# EAGLE design 3_cpu_control (EAGLE 6.6.0)

## Sheet 1 of 2
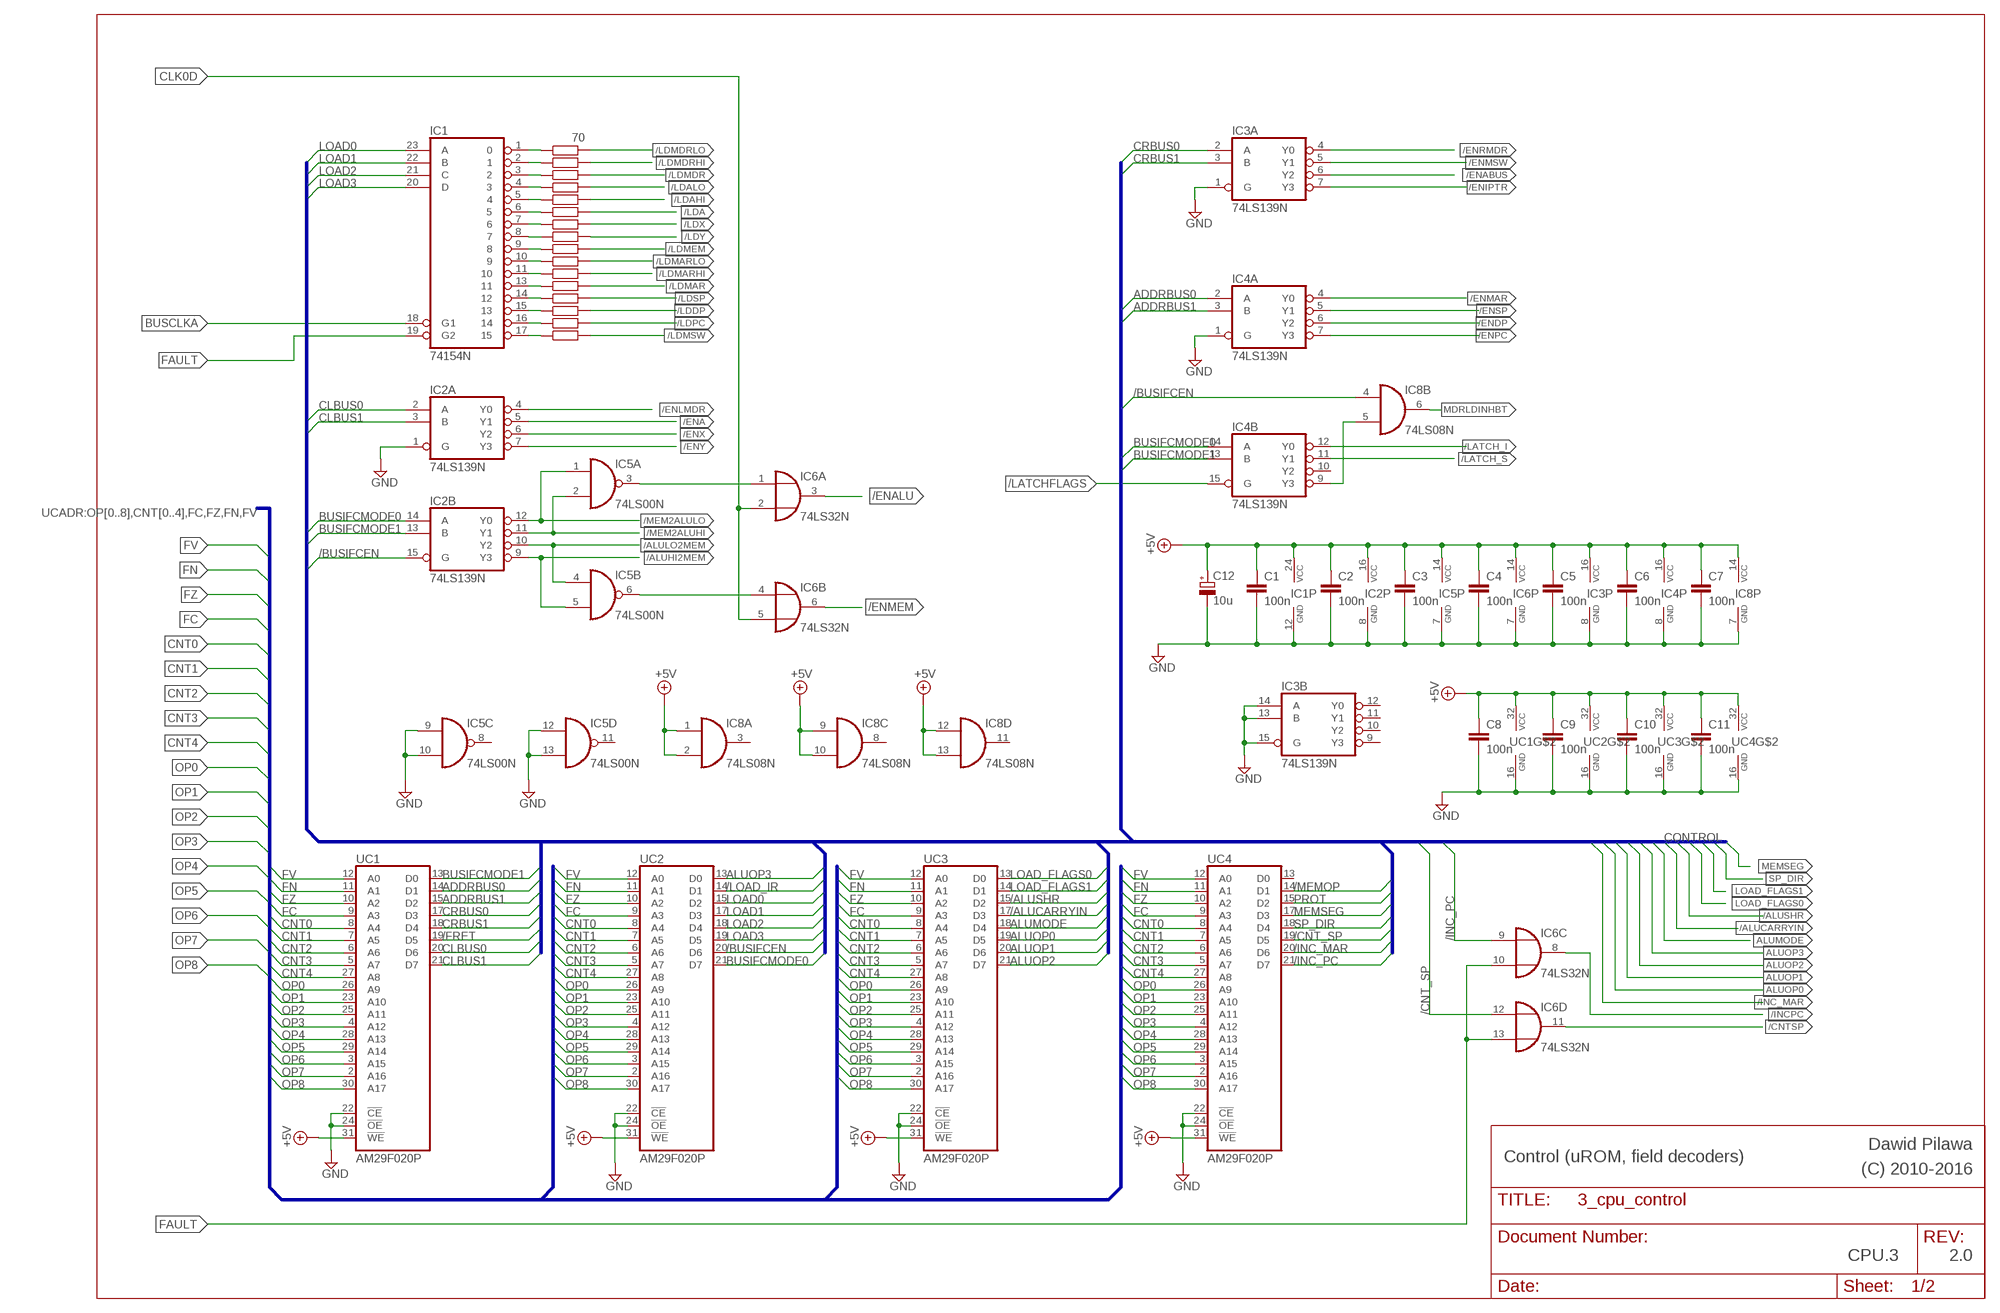
[diagram p0: schematic, sheet 1]

### Parts
C1  100n  C-EU050-024X044  [C050-024X044]
C2  100n  C-EU050-024X044  [C050-024X044]
C3  100n  C-EU050-024X044  [C050-024X044]
C4  100n  C-EU050-024X044  [C050-024X044]
C5  100n  C-EU050-024X044  [C050-024X044]
C6  100n  C-EU050-024X044  [C050-024X044]
C7  100n  C-EU050-024X044  [C050-024X044]
C8  100n  C-EU050-024X044  [C050-024X044]
C9  100n  C-EU050-024X044  [C050-024X044]
C10  100n  C-EU050-024X044  [C050-024X044]
C11  100n  C-EU050-024X044  [C050-024X044]
C12  10u  CPOL-EUE5-6  [E5-6]
IC1  74154N  [DIL24-6]
IC2  74LS139N  [DIL16]
IC3  74LS139N  [DIL16]
IC4  74LS139N  [DIL16]
IC5  74LS00N  [DIL14]
IC6  74LS32N  [DIL14]
IC8  74LS08N  [DIL14]
R1  70  R-EU_0204/7  [0204/7]
R2  R-EU_0204/7  [0204/7]
R3  R-EU_0204/7  [0204/7]
R4  R-EU_0204/7  [0204/7]
R5  R-EU_0204/7  [0204/7]
R6  R-EU_0204/7  [0204/7]
R7  R-EU_0204/7  [0204/7]
R8  R-EU_0204/7  [0204/7]
R9  R-EU_0204/7  [0204/7]
R10  R-EU_0204/7  [0204/7]
R11  R-EU_0204/7  [0204/7]
R12  R-EU_0204/7  [0204/7]
R13  R-EU_0204/7  [0204/7]
R14  R-EU_0204/7  [0204/7]
R15  R-EU_0204/7  [0204/7]
R16  R-EU_0204/7  [0204/7]
UC1  AM29F020P  [DIL32-6]
UC2  AM29F020P  [DIL32-6]
UC3  AM29F020P  [DIL32-6]
UC4  AM29F020P  [DIL32-6]

### Nets
+5V: C1.1 C2.1 C3.1 C4.1 C5.1 C6.1 C7.1 C8.1 C9.1 C10.1 C11.1 C12.+ IC1.24(VCC) IC2.16(P:VCC) IC3.16(P:VCC) IC4.16(P:VCC) IC5.14(P:VCC) IC6.14(P:VCC) IC8.1(A:I0) IC8.2(A:I1) IC8.9(C:I0) IC8.10(C:I1) IC8.12(D:I0) IC8.13(D:I1) IC8.14(P:VCC) UC1.31(!WE) UC1.32(AVCC) UC2.31(!WE) UC2.32(AVCC) UC3.31(!WE) UC3.32(AVCC) UC4.31(!WE) UC4.32(AVCC) ; also sheet 2
/ALUCARRYIN: UC3.17(D3) ; also sheet 2
/ALUHI2MEM: IC2.9(B:Y3) IC5.5(B:I1) ; also sheet 2
/ALULO2MEM: IC2.10(B:Y2) IC5.4(B:I0) ; also sheet 2
/ALUSHR: UC3.15(D2) ; also sheet 2
/BUSIFCEN: IC2.15(B:G) IC8.4(B:I0) UC2.20(D6) ; also sheet 2
/CNT_SP: IC6.12(D:I0) UC4.19(D5)
/CNTSP: IC6.11(D:O) ; also sheet 2
/ENA: IC2.5(A:Y1) ; also sheet 2
/ENABUS: IC3.6(A:Y2) ; also sheet 2
/ENALU: IC6.3(A:O) ; also sheet 2
/ENDP: IC4.6(A:Y2) ; also sheet 2
/ENIPTR: IC3.7(A:Y3) ; also sheet 2
/ENLMDR: IC2.4(A:Y0) ; also sheet 2
/ENMAR: IC4.4(A:Y0) ; also sheet 2
/ENMEM: IC6.6(B:O) ; also sheet 2
/ENMSW: IC3.5(A:Y1) ; also sheet 2
/ENPC: IC4.7(A:Y3) ; also sheet 2
/ENRMDR: IC3.4(A:Y0) ; also sheet 2
/ENSP: IC4.5(A:Y1) ; also sheet 2
/ENX: IC2.6(A:Y2) ; also sheet 2
/ENY: IC2.7(A:Y3) ; also sheet 2
/FRET: UC1.19(D5) ; also sheet 2
/INC_MAR: UC4.20(D6) ; also sheet 2
/INC_PC: IC6.9(C:I0) UC4.21(D7)
/INCPC: IC6.8(C:O) ; also sheet 2
/LATCH_I: IC4.12(B:Y0) ; also sheet 2
/LATCH_NONE: IC4.9(B:Y3) IC8.5(B:I1)
/LATCH_S: IC4.11(B:Y1) ; also sheet 2
/LATCHFLAGS: IC4.15(B:G) ; also sheet 2
/LDA: R6.2 ; also sheet 2
/LDAHI: R5.2 ; also sheet 2
/LDALO: R4.2 ; also sheet 2
/LDDP: R14.2 ; also sheet 2
/LDMAR: R12.2 ; also sheet 2
/LDMARHI: R11.2 ; also sheet 2
/LDMARLO: R10.2 ; also sheet 2
/LDMDR: R3.2 ; also sheet 2
/LDMDRHI: R2.2 ; also sheet 2
/LDMDRLO: R1.2 ; also sheet 2
/LDMEM: R9.2 ; also sheet 2
/LDMSW: R16.2 ; also sheet 2
/LDPC: R15.2 ; also sheet 2
/LDSP: R13.2 ; also sheet 2
/LDX: R7.2 ; also sheet 2
/LDY: R8.2 ; also sheet 2
/LOAD_IR: UC2.14(D1) ; also sheet 2
/MEM2ALUHI: IC2.11(B:Y1) IC5.2(A:I1) ; also sheet 2
/MEM2ALULO: IC2.12(B:Y0) IC5.1(A:I0) ; also sheet 2
/MEMOP: UC4.14(D1) ; also sheet 2
ADDRBUS0: IC4.2(A:A) UC1.14(D1)
ADDRBUS1: IC4.3(A:B) UC1.15(D2)
ALUMODE: UC3.18(D4) ; also sheet 2
ALUOP0: UC3.19(D5) ; also sheet 2
ALUOP1: UC3.20(D6) ; also sheet 2
ALUOP2: UC3.21(D7) ; also sheet 2
ALUOP3: UC2.13(D0) ; also sheet 2
BUSCLKA: IC1.18(G1) ; also sheet 2
BUSIFCMODE0: IC2.14(B:A) IC4.14(B:A) UC2.21(D7)
BUSIFCMODE1: IC2.13(B:B) IC4.13(B:B) UC1.13(D0)
CLBUS0: IC2.2(A:A) UC1.20(D6)
CLBUS1: IC2.3(A:B) UC1.21(D7)
CLK0D: IC6.2(A:I1) IC6.5(B:I1) ; also sheet 2
CNT0: UC1.8(A4) UC2.8(A4) UC3.8(A4) UC4.8(A4) ; also sheet 2
CNT1: UC1.7(A5) UC2.7(A5) UC3.7(A5) UC4.7(A5) ; also sheet 2
CNT2: UC1.6(A6) UC2.6(A6) UC3.6(A6) UC4.6(A6) ; also sheet 2
CNT3: UC1.5(A7) UC2.5(A7) UC3.5(A7) UC4.5(A7) ; also sheet 2
CNT4: UC1.27(A8) UC2.27(A8) UC3.27(A8) UC4.27(A8) ; also sheet 2
CRBUS0: IC3.2(A:A) UC1.17(D3)
CRBUS1: IC3.3(A:B) UC1.18(D4)
FAULT: IC1.19(G2) IC6.10(C:I1) IC6.13(D:I1) ; also sheet 2
FC: UC1.9(A3) UC2.9(A3) UC3.9(A3) UC4.9(A3) ; also sheet 2
FN: UC1.11(A1) UC2.11(A1) UC3.11(A1) UC4.11(A1) ; also sheet 2
FV: UC1.12(A0) UC2.12(A0) UC3.12(A0) UC4.12(A0) ; also sheet 2
FZ: UC1.10(A2) UC2.10(A2) UC3.10(A2) UC4.10(A2) ; also sheet 2
GND: C1.2 C2.2 C3.2 C4.2 C5.2 C6.2 C7.2 C8.2 C9.2 C10.2 C11.2 C12.- IC1.12(GND) IC2.1(A:G) IC2.8(P:GND) IC3.1(A:G) IC3.8(P:GND) IC3.13(B:B) IC3.14(B:A) IC3.15(B:G) IC4.1(A:G) IC4.8(P:GND) IC5.7(P:GND) IC5.9(C:I0) IC5.10(C:I1) IC5.12(D:I0) IC5.13(D:I1) IC6.7(P:GND) IC8.7(P:GND) UC1.16(AGND) UC1.22(!CE) UC1.24(!OE) UC2.16(AGND) UC2.22(!CE) UC2.24(!OE) UC3.16(AGND) UC3.22(!CE) UC3.24(!OE) UC4.16(AGND) UC4.22(!CE) UC4.24(!OE) ; also sheet 2
LOAD0: IC1.23(A) UC2.15(D2)
LOAD1: IC1.22(B) UC2.17(D3)
LOAD2: IC1.21(C) UC2.18(D4)
LOAD3: IC1.20(D) UC2.19(D5)
LOAD_FLAGS0: UC3.13(D0) ; also sheet 2
LOAD_FLAGS1: UC3.14(D1) ; also sheet 2
MDRLDINHBT: IC8.6(B:O) ; also sheet 2
MEMSEG: UC4.17(D3) ; also sheet 2
N$1: IC1.16 R15.1
N$8: IC5.3(A:O) IC6.1(A:I0)
N$15: IC5.6(B:O) IC6.4(B:I0)
N$31: IC1.1 R1.1
N$33: IC1.2 R2.1
N$34: IC1.3 R3.1
N$35: IC1.4 R4.1
N$36: IC1.5 R5.1
N$37: IC1.6 R6.1
N$38: IC1.7 R7.1
N$39: IC1.8 R8.1
N$40: IC1.9 R9.1
N$41: IC1.10 R10.1
N$42: IC1.11 R11.1
N$43: IC1.13 R12.1
N$44: IC1.14 R13.1
N$45: IC1.15 R14.1
N$56: IC1.17 R16.1
OP0: UC1.26(A9) UC2.26(A9) UC3.26(A9) UC4.26(A9) ; also sheet 2
OP1: UC1.23(A10) UC2.23(A10) UC3.23(A10) UC4.23(A10) ; also sheet 2
OP2: UC1.25(A11) UC2.25(A11) UC3.25(A11) UC4.25(A11) ; also sheet 2
OP3: UC1.4(A12) UC2.4(A12) UC3.4(A12) UC4.4(A12) ; also sheet 2
OP4: UC1.28(A13) UC2.28(A13) UC3.28(A13) UC4.28(A13) ; also sheet 2
OP5: UC1.29(A14) UC2.29(A14) UC3.29(A14) UC4.29(A14) ; also sheet 2
OP6: UC1.3(A15) UC2.3(A15) UC3.3(A15) UC4.3(A15) ; also sheet 2
OP7: UC1.2(A16) UC2.2(A16) UC3.2(A16) UC4.2(A16) ; also sheet 2
OP8: UC1.30(A17) UC2.30(A17) UC3.30(A17) UC4.30(A17) ; also sheet 2
PROT: UC4.15(D2) ; also sheet 2
SP_DIR: UC4.18(D4) ; also sheet 2
Unconnected: IC3.9(B:Y3) IC3.10(B:Y2) IC3.11(B:Y1) IC3.12(B:Y0) IC4.10(B:Y2) IC5.8(C:O) IC5.11(D:O) IC8.3(A:O) IC8.8(C:O) IC8.11(D:O) UC4.13(D0)

### Buses
UCADR:OP[0..8],CNT[0..4],FC,FZ,FN,FV
UCODE:CLBUS[0..1],CRBUS[0..2],ADDRBUS[0..1],BUSIFCMODE[0..1],/BUSIFCEN,LOAD[0..3],/LOAD_IR,ALUOP[0..3],ALUMODE,/ALUCARRYIN,/ALUSHR,LOAD_FLAGS[0..1],/INC_PC,/INC_MAR,/CNT_SP,SP_DIR,MEMSEG,PROT,NC[0..1],NEXTOP
UCODE:CLBUS[0..1],CRBUS[0..1],ADDRBUS[0..1],BUSIFCMODE[0..1],/BUSIFCEN,LOAD[0..3],/LOAD_IR,ALUOP[0..3],ALUMODE,/ALUCARRYIN,/ALUSHR,LOAD_FLAGS[0..1],/INC_PC,/INC_MAR,/CNT_SP,SP_DIR,MEMSEG,PROT,NC[0..1],NEXTOP,/MEMOP,/FRET

### Notes on the sheet
- CONTROL
- Dawid Pilawa
- Control (uROM, field decoders) | (C) 2010-2016
- CPU.3 | 2.0

## Sheet 2 of 2
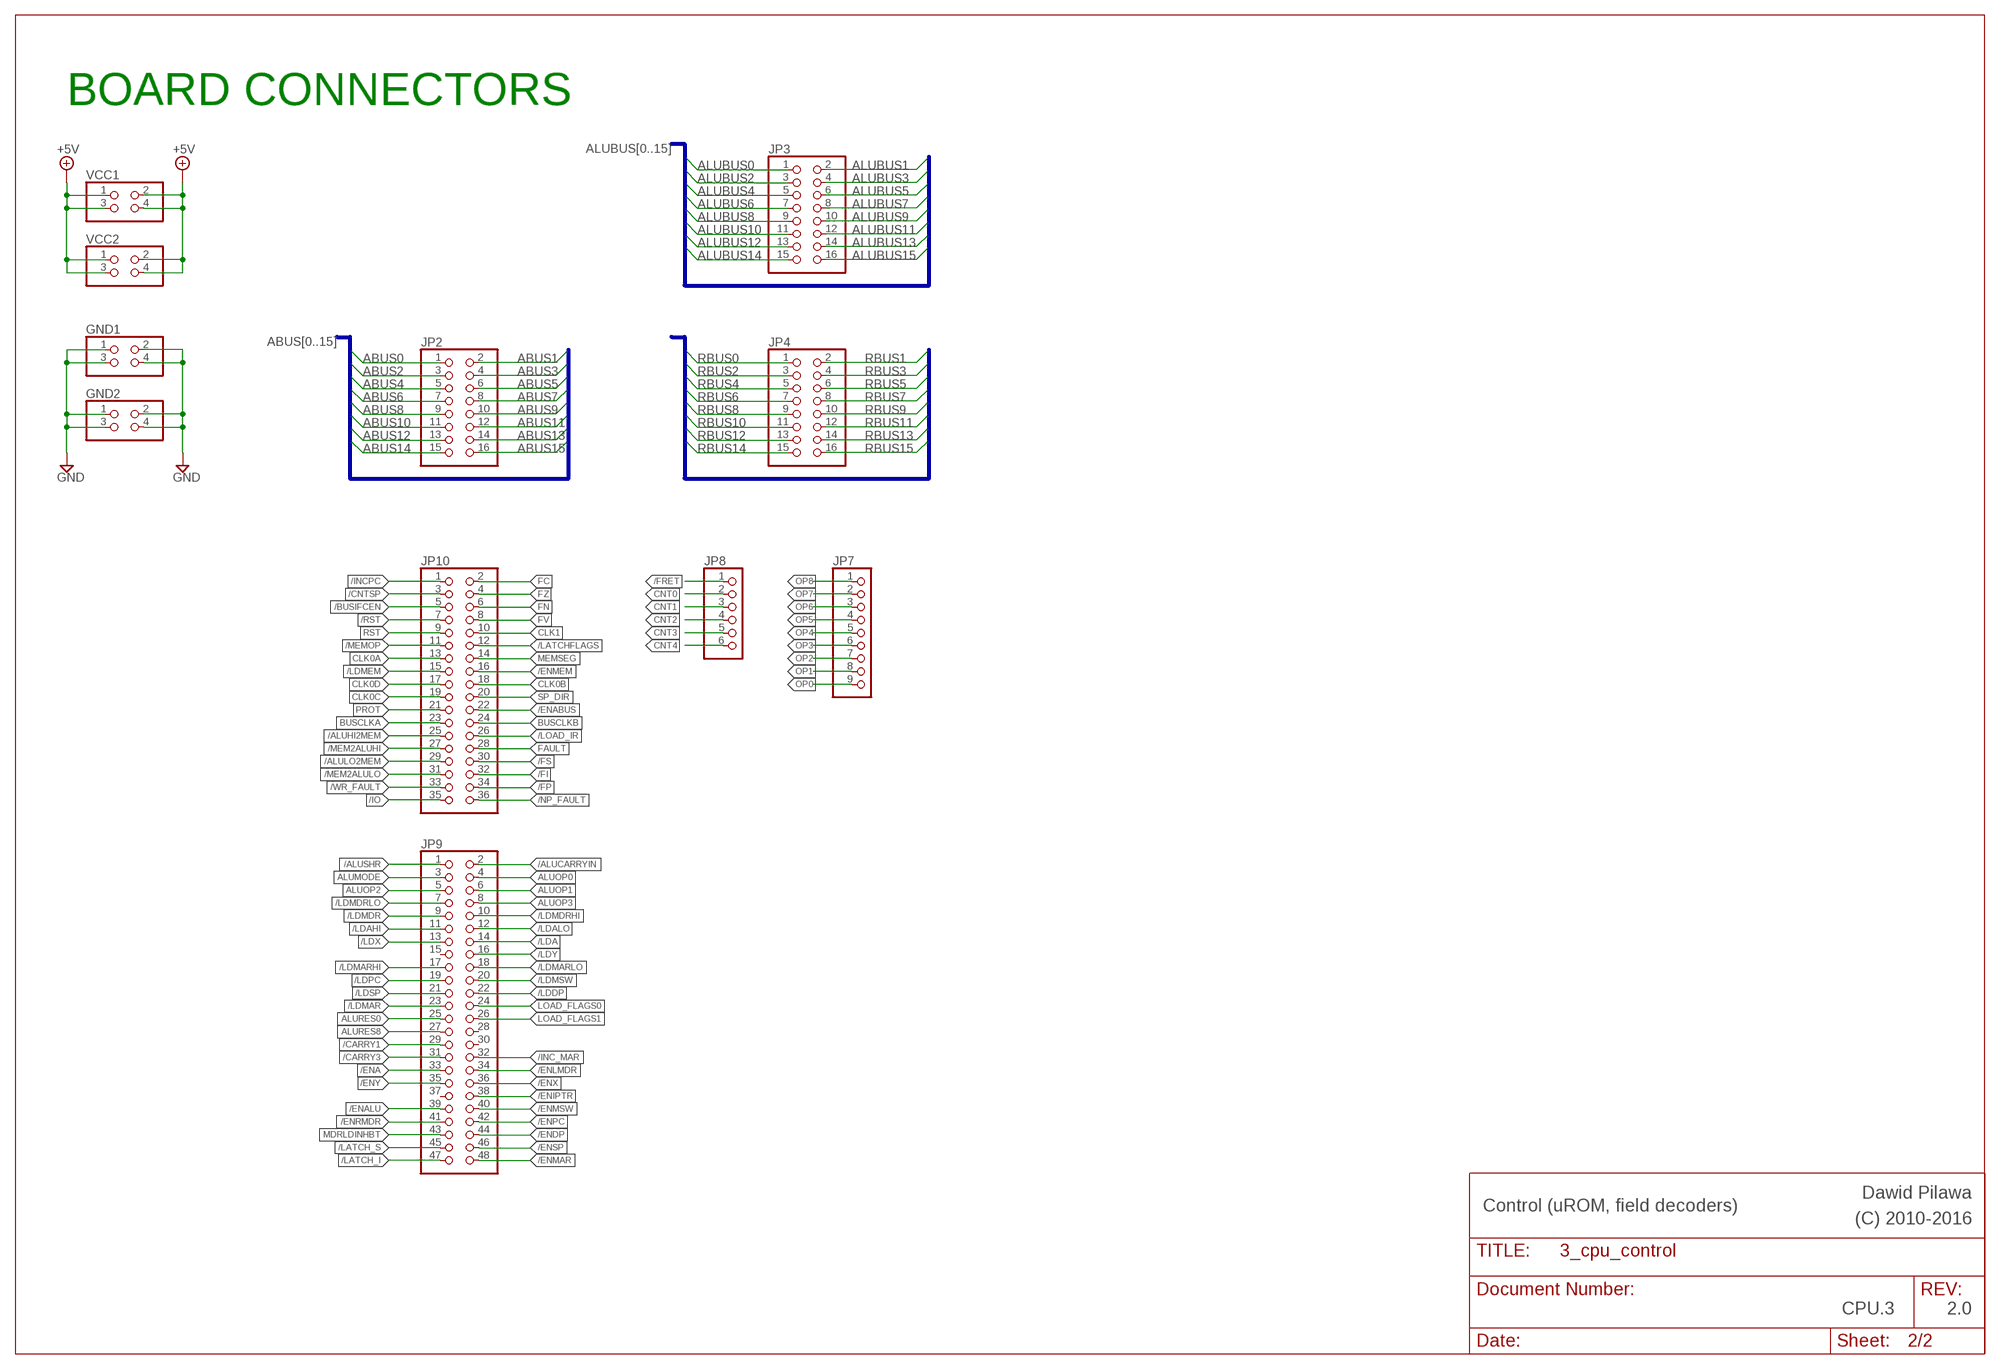
[diagram p1: schematic, sheet 2]

### Parts
GND1  PINHD-2X2  [2X02]
GND2  PINHD-2X2  [2X02]
JP2  PINHD-2X8  [2X08]
JP3  PINHD-2X8  [2X08]
JP4  PINHD-2X8  [2X08]
JP7  PINHD-1X9  [1X09]
JP8  PINHD-1X6  [1X06]
JP9  PINHD-2X24  [2X24]
JP10  PINHD-2X18  [2X18]
VCC1  PINHD-2X2  [2X02]
VCC2  PINHD-2X2  [2X02]

### Nets
+5V: VCC1.1 VCC1.2 VCC1.3 VCC1.4 VCC2.1 VCC2.2 VCC2.3 VCC2.4 ; also sheet 1
/ALUCARRYIN: JP9.2 ; also sheet 1
/ALUHI2MEM: JP10.25 ; also sheet 1
/ALULO2MEM: JP10.29 ; also sheet 1
/ALUSHR: JP9.1 ; also sheet 1
/BUSIFCEN: JP10.5 ; also sheet 1
/CARRY1: JP9.29
/CARRY3: JP9.31
/CNTSP: JP10.3 ; also sheet 1
/ENA: JP9.33 ; also sheet 1
/ENABUS: JP10.22 ; also sheet 1
/ENALU: JP9.39 ; also sheet 1
/ENDP: JP9.44 ; also sheet 1
/ENIPTR: JP9.38 ; also sheet 1
/ENLMDR: JP9.34 ; also sheet 1
/ENMAR: JP9.48 ; also sheet 1
/ENMEM: JP10.16 ; also sheet 1
/ENMSW: JP9.40 ; also sheet 1
/ENPC: JP9.42 ; also sheet 1
/ENRMDR: JP9.41 ; also sheet 1
/ENSP: JP9.46 ; also sheet 1
/ENX: JP9.36 ; also sheet 1
/ENY: JP9.35 ; also sheet 1
/FI: JP10.32
/FP: JP10.34
/FRET: JP8.1 ; also sheet 1
/FS: JP10.30
/INC_MAR: JP9.32 ; also sheet 1
/INCPC: JP10.1 ; also sheet 1
/IO: JP10.35
/LATCH_I: JP9.47 ; also sheet 1
/LATCH_S: JP9.45 ; also sheet 1
/LATCHFLAGS: JP10.12 ; also sheet 1
/LDA: JP9.14 ; also sheet 1
/LDAHI: JP9.11 ; also sheet 1
/LDALO: JP9.12 ; also sheet 1
/LDDP: JP9.22 ; also sheet 1
/LDMAR: JP9.23 ; also sheet 1
/LDMARHI: JP9.17 ; also sheet 1
/LDMARLO: JP9.18 ; also sheet 1
/LDMDR: JP9.9 ; also sheet 1
/LDMDRHI: JP9.10 ; also sheet 1
/LDMDRLO: JP9.7 ; also sheet 1
/LDMEM: JP10.15 ; also sheet 1
/LDMSW: JP9.20 ; also sheet 1
/LDPC: JP9.19 ; also sheet 1
/LDSP: JP9.21 ; also sheet 1
/LDX: JP9.13 ; also sheet 1
/LDY: JP9.16 ; also sheet 1
/LOAD_IR: JP10.26 ; also sheet 1
/MEM2ALUHI: JP10.27 ; also sheet 1
/MEM2ALULO: JP10.31 ; also sheet 1
/MEMOP: JP10.11 ; also sheet 1
/NP_FAULT: JP10.36
/RST: JP10.7
/WR_FAULT: JP10.33
ABUS0: JP2.1
ABUS1: JP2.2
ABUS2: JP2.3
ABUS3: JP2.4
ABUS4: JP2.5
ABUS5: JP2.6
ABUS6: JP2.7
ABUS7: JP2.8
ABUS8: JP2.9
ABUS9: JP2.10
ABUS10: JP2.11
ABUS11: JP2.12
ABUS12: JP2.13
ABUS13: JP2.14
ABUS14: JP2.15
ABUS15: JP2.16
ALUBUS0: JP3.1
ALUBUS1: JP3.2
ALUBUS2: JP3.3
ALUBUS3: JP3.4
ALUBUS4: JP3.5
ALUBUS5: JP3.6
ALUBUS6: JP3.7
ALUBUS7: JP3.8
ALUBUS8: JP3.9
ALUBUS9: JP3.10
ALUBUS10: JP3.11
ALUBUS11: JP3.12
ALUBUS12: JP3.13
ALUBUS13: JP3.14
ALUBUS14: JP3.15
ALUBUS15: JP3.16
ALUMODE: JP9.3 ; also sheet 1
ALUOP0: JP9.4 ; also sheet 1
ALUOP1: JP9.6 ; also sheet 1
ALUOP2: JP9.5 ; also sheet 1
ALUOP3: JP9.8 ; also sheet 1
ALURES0: JP9.25
ALURES8: JP9.27
BUSCLKA: JP10.23 ; also sheet 1
BUSCLKB: JP10.24
CLK0A: JP10.13
CLK0B: JP10.18
CLK0C: JP10.19
CLK0D: JP10.17 ; also sheet 1
CLK1: JP10.10
CNT0: JP8.2 ; also sheet 1
CNT1: JP8.3 ; also sheet 1
CNT2: JP8.4 ; also sheet 1
CNT3: JP8.5 ; also sheet 1
CNT4: JP8.6 ; also sheet 1
FAULT: JP10.28 ; also sheet 1
FC: JP10.2 ; also sheet 1
FN: JP10.6 ; also sheet 1
FV: JP10.8 ; also sheet 1
FZ: JP10.4 ; also sheet 1
GND: GND1.1 GND1.2 GND1.3 GND1.4 GND2.1 GND2.2 GND2.3 GND2.4 ; also sheet 1
LOAD_FLAGS0: JP9.24 ; also sheet 1
LOAD_FLAGS1: JP9.26 ; also sheet 1
MDRLDINHBT: JP9.43 ; also sheet 1
MEMSEG: JP10.14 ; also sheet 1
OP0: JP7.9 ; also sheet 1
OP1: JP7.8 ; also sheet 1
OP2: JP7.7 ; also sheet 1
OP3: JP7.6 ; also sheet 1
OP4: JP7.5 ; also sheet 1
OP5: JP7.4 ; also sheet 1
OP6: JP7.3 ; also sheet 1
OP7: JP7.2 ; also sheet 1
OP8: JP7.1 ; also sheet 1
PROT: JP10.21 ; also sheet 1
RBUS0: JP4.1
RBUS1: JP4.2
RBUS2: JP4.3
RBUS3: JP4.4
RBUS4: JP4.5
RBUS5: JP4.6
RBUS6: JP4.7
RBUS7: JP4.8
RBUS8: JP4.9
RBUS9: JP4.10
RBUS10: JP4.11
RBUS11: JP4.12
RBUS12: JP4.13
RBUS13: JP4.14
RBUS14: JP4.15
RBUS15: JP4.16
RST: JP10.9
SP_DIR: JP10.20 ; also sheet 1
Unconnected: JP9.15 JP9.28 JP9.30 JP9.37

### Buses
ALUBUS[0..15]
RBUS[0..15]
ABUS[0..15]

### Notes on the sheet
- BOARD CONNECTORS
- Dawid Pilawa
- Control (uROM, field decoders) | (C) 2010-2016
- CPU.3 | 2.0

## Library data of the parts
C1-C11 = rcl:C-EU: CAPACITOR, European symbol
C12 = rcl:CPOL-EU: POLARIZED CAPACITOR, European symbol
GND1 GND2 VCC1 VCC2 = pinhead:PINHD-2X2: PIN HEADER
IC1 = 74xx-eu:74*154: 4-line to 16-line data SELECTOR/MULTIPLEXER
IC2-IC4 = 74xx-eu:74*139: Dual 2-line to 4-line DECODER/DEMULTIPLEXER
IC5 = 74xx-eu:74*00: Quad 2-input NAND gate
IC6 = 74xx-eu:74*32: Quad 2-input OR gate
IC8 = 74xx-eu:74*08: Quad 2-input AND gate
JP2-JP4 = pinhead:PINHD-2X8: PIN HEADER
JP7 = pinhead:PINHD-1X9: PIN HEADER
JP8 = pinhead:PINHD-1X6: PIN HEADER
JP9 = pinhead:PINHD-2X24: PIN HEADER
JP10 = pinhead:PINHD-2X18: PIN HEADER
R1-R16 = rcl:R-EU_: RESISTOR, European symbol
UC1-UC4 = am29-memory:AM29F020P: 20F020 - 256kB FLASH

## Board
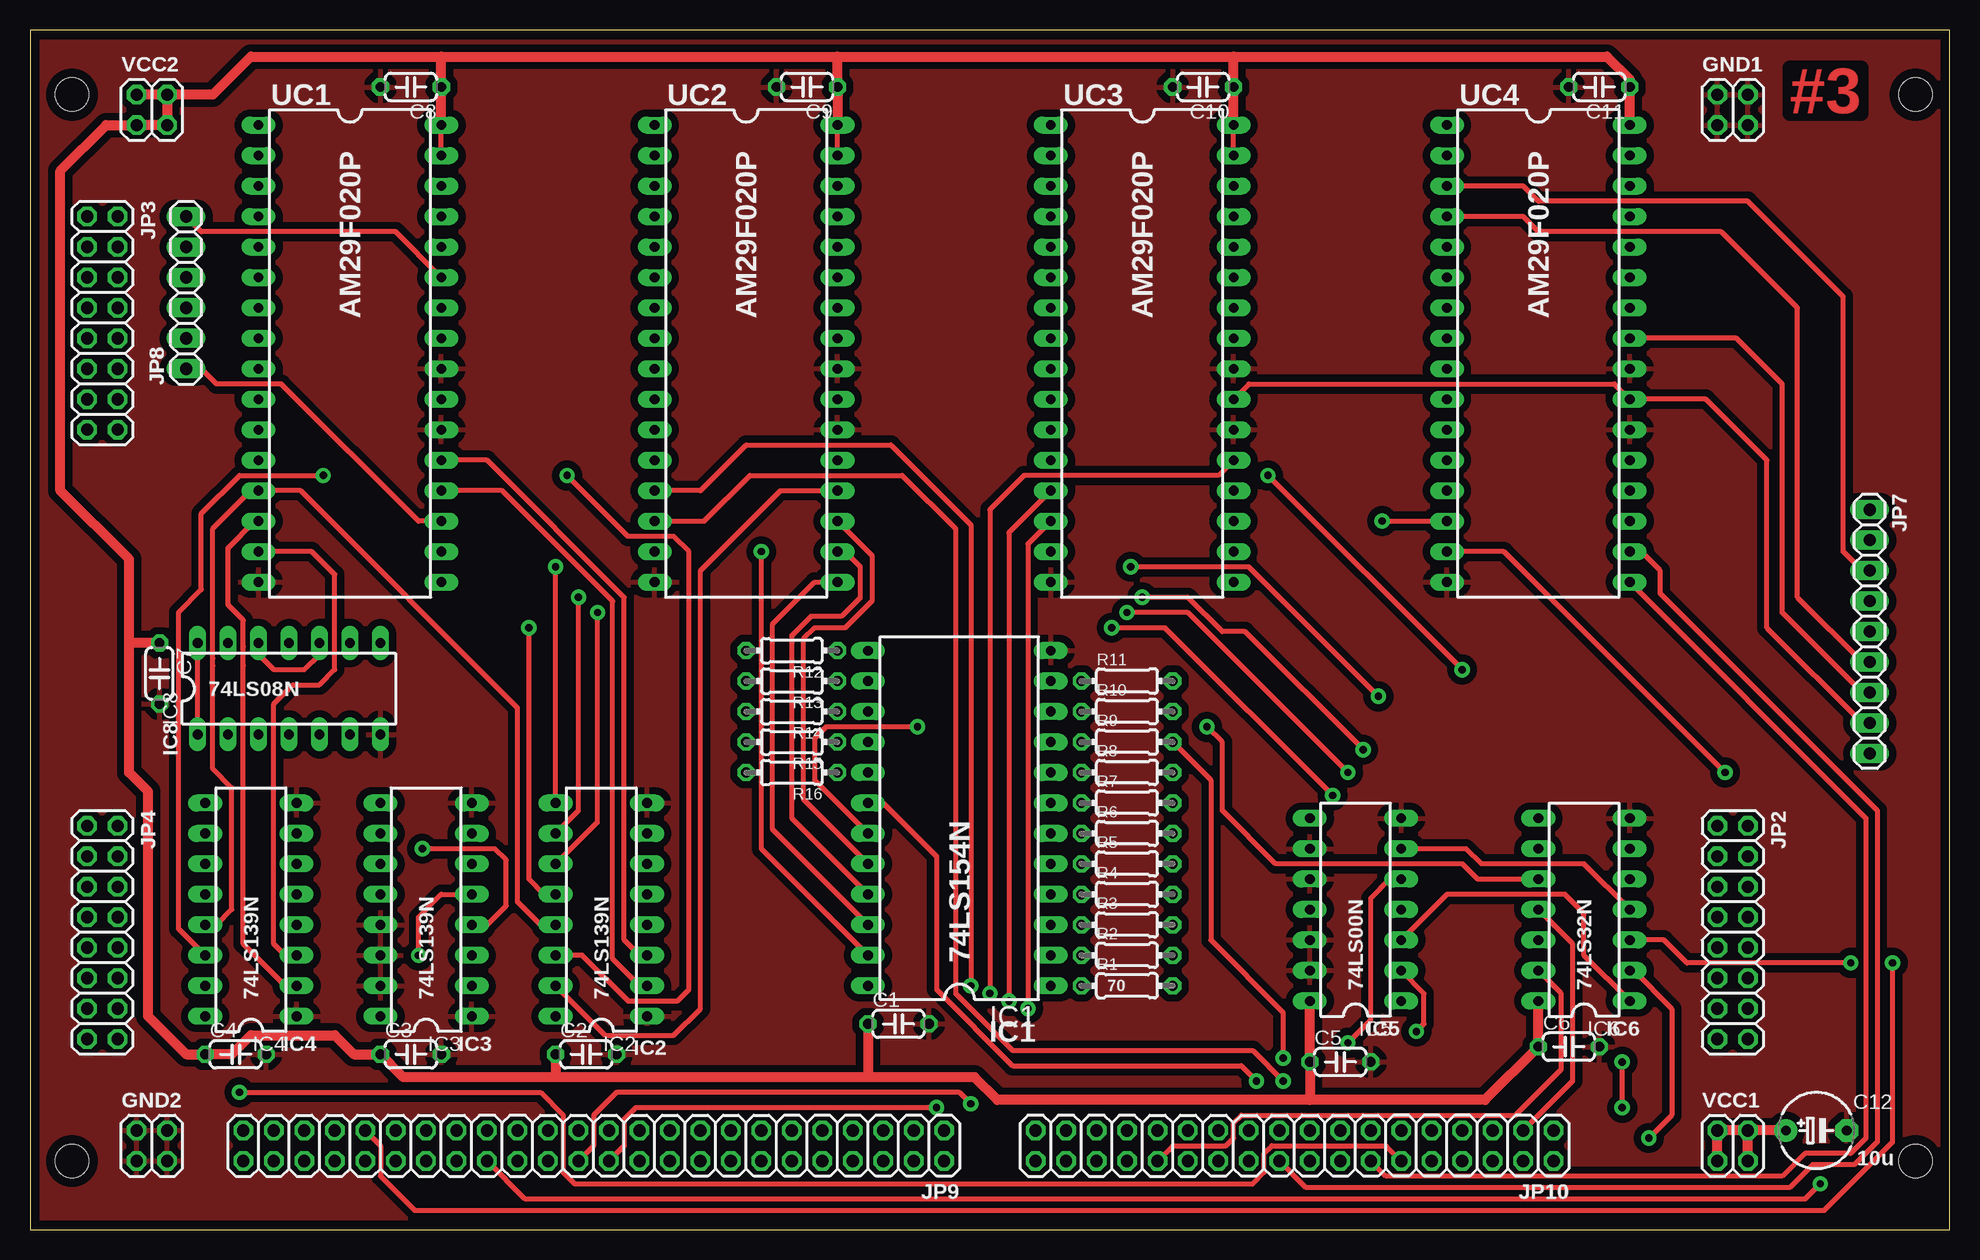
[diagram p2: board, top side]
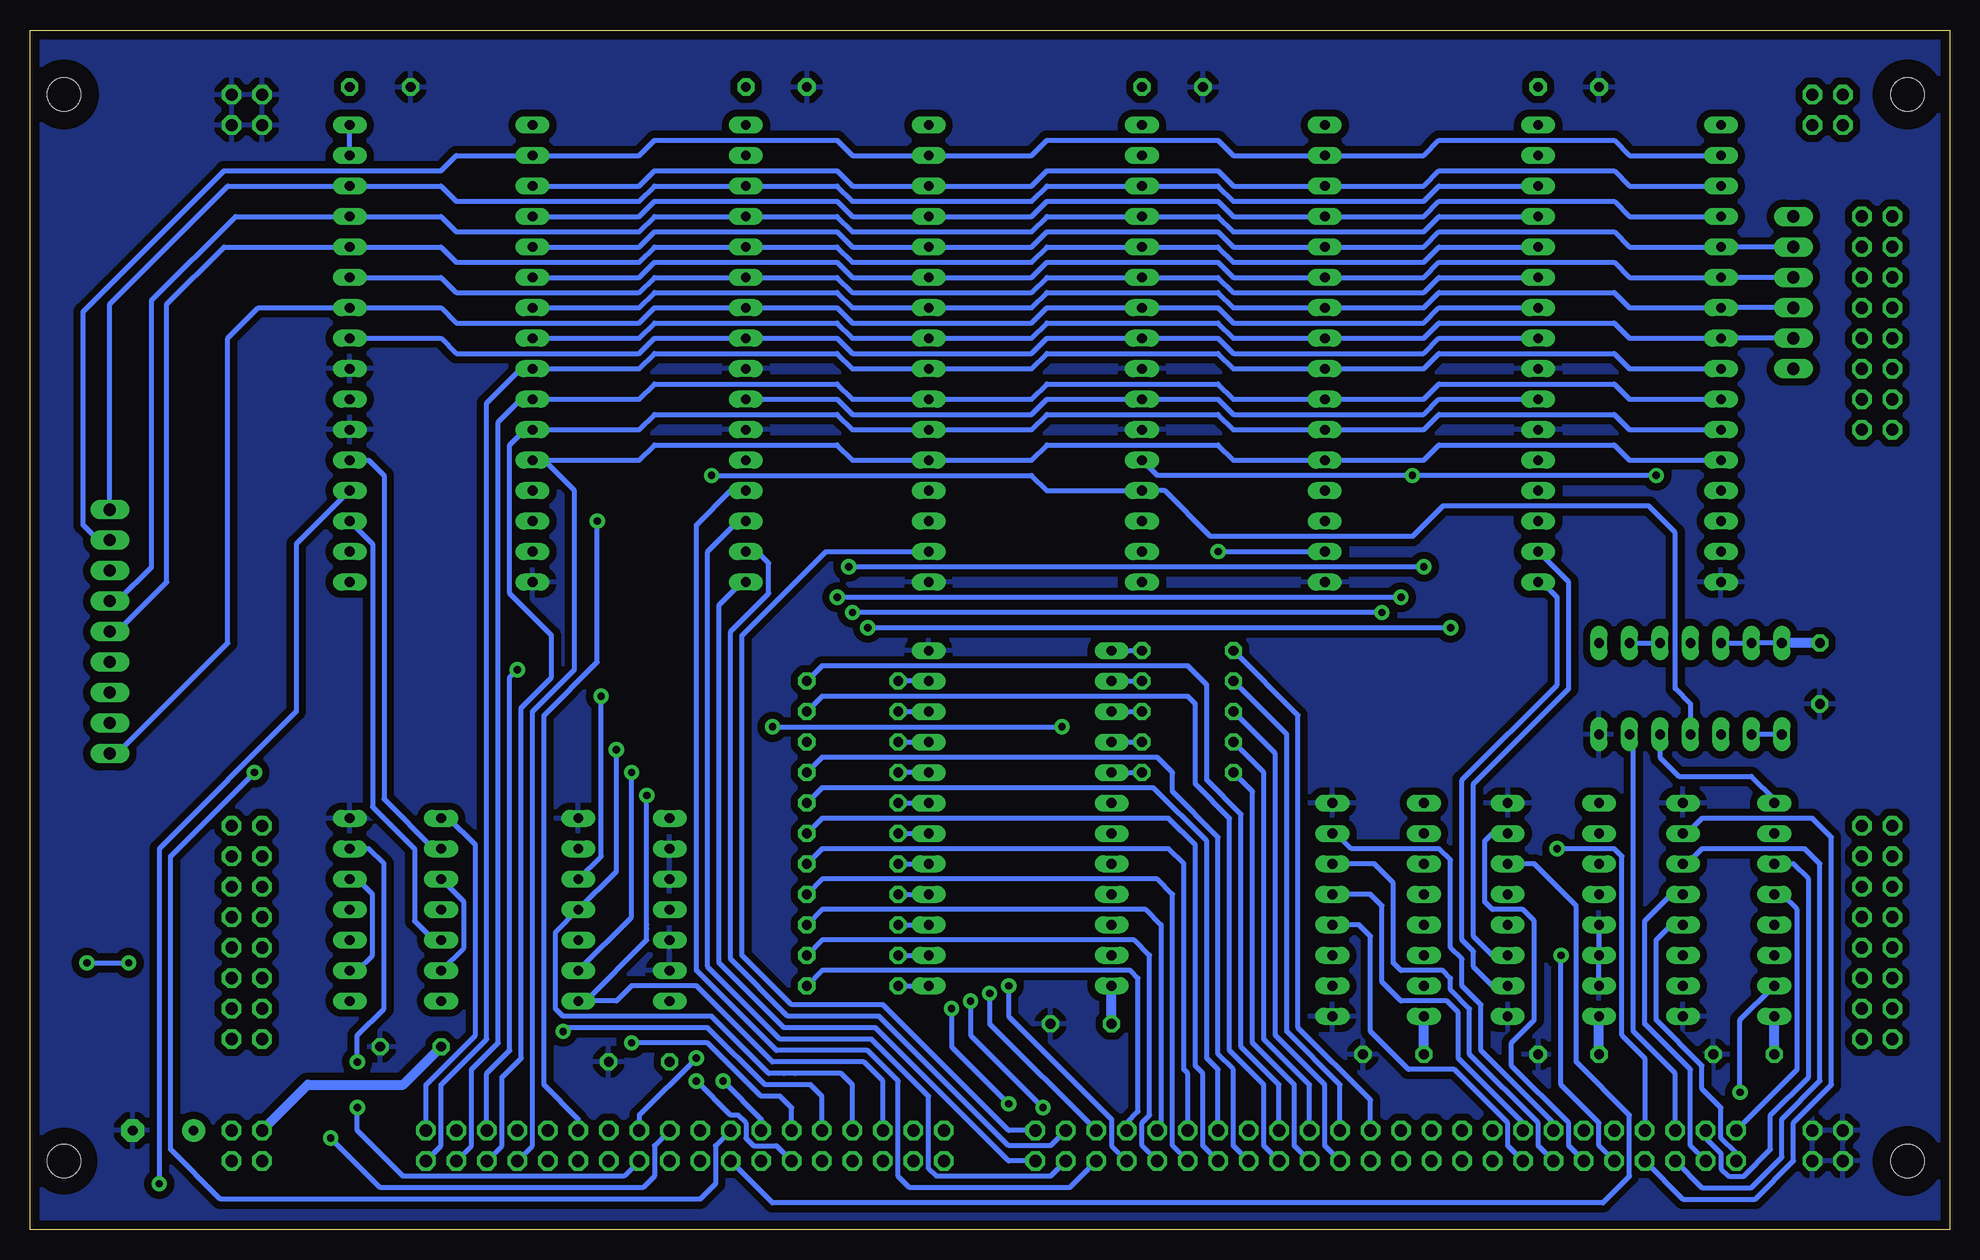
[diagram p3: board, bottom side, seen from below]

Size 160 x 100 mm. Coordinates in mm from the lower left corner, seen from the top.
Outline: 0,0 160,0 160,100 0,100 0,0
Copper layers (1*16): Top 0.035mm / dielectric 1.5mm / Bottom 0.035mm
Design rules "homebrew_pcb": minimum track width 16mil, minimum drill 24mil, track to track 16mil, track to pad 10mil, pad to pad 10mil, via to via 10mil, smd to smd 8mil, copper to edge 30mil, drill to drill 10mil, minimum pad ring 12mil, minimum via ring 12mil, stop-mask expansion 4mil, vias tented up to drill 0mil, thermal gap 24mil
Holes 2.79 mm at 3.49,94.61 157.16,94.61 157.16,5.71 3.49,5.71
bRestrict: area 1.2,3.4 to 5.8,8; area 155,3.6 to 159.3,7.9; area 154.9,92.3 to 159.4,96.9; area 1.2,92.3 to 5.8,96.9
vRestrict: area 155,3.6 to 159.3,7.9; area 154.9,92.3 to 159.4,96.9; area 1.2,3.4 to 5.8,8; area 1.2,92.3 to 5.8,96.9

### Footprints (pad centres in the part's own frame; a part is rotated, then mirrored left to right if it is on the bottom)
C050-024X044 = drill 0.813 octagon: 1 -2.54,0; 2 2.54,0
E5-6 = drill 0.813 pad 1.905: + -2.54,0 | drill 0.813 pad 1.905 octagon: - 2.54,0
2X02 = drill 1.016 octagon: 1 -1.27,-1.27; 2 -1.27,1.27; 3 1.27,-1.27; 4 1.27,1.27
DIL24-6 = drill 0.813 long: 1 -13.97,-7.62; 2 -11.43,-7.62; 3 -8.89,-7.62; 4 -6.35,-7.62; 5 -3.81,-7.62; 6 -1.27,-7.62; 7 1.27,-7.62; 8 3.81,-7.62; 9 6.35,-7.62; 10 8.89,-7.62; 11 11.43,-7.62; 12 13.97,-7.62; 13 13.97,7.62; 14 11.43,7.62; 15 8.89,7.62; 16 6.35,7.62; 17 3.81,7.62; 18 1.27,7.62; 19 -1.27,7.62; 20 -3.81,7.62; 21 -6.35,7.62; 22 -8.89,7.62; 23 -11.43,7.62; 24 -13.97,7.62
DIL16 = drill 0.813 long: 1 -8.89,-3.81; 2 -6.35,-3.81; 3 -3.81,-3.81; 4 -1.27,-3.81; 5 1.27,-3.81; 6 3.81,-3.81; 7 6.35,-3.81; 8 8.89,-3.81; 9 8.89,3.81; 10 6.35,3.81; 11 3.81,3.81; 12 1.27,3.81; 13 -1.27,3.81; 14 -3.81,3.81; 15 -6.35,3.81; 16 -8.89,3.81
DIL14 = drill 0.813 long: 1 -7.62,-3.81; 2 -5.08,-3.81; 3 -2.54,-3.81; 4 0,-3.81; 5 2.54,-3.81; 6 5.08,-3.81; 7 7.62,-3.81; 8 7.62,3.81; 9 5.08,3.81; 10 2.54,3.81; 11 0,3.81; 12 -2.54,3.81; 13 -5.08,3.81; 14 -7.62,3.81
2X08 = drill 1.016 octagon: 1 -8.89,-1.27; 2 -8.89,1.27; 3 -6.35,-1.27; 4 -6.35,1.27; 5 -3.81,-1.27; 6 -3.81,1.27; 7 -1.27,-1.27; 8 -1.27,1.27; 9 1.27,-1.27; 10 1.27,1.27; 11 3.81,-1.27; 12 3.81,1.27; 13 6.35,-1.27; 14 6.35,1.27; 15 8.89,-1.27; 16 8.89,1.27
1X09 = drill 1.016 long: 1 -10.16,0; 2 -7.62,0; 3 -5.08,0; 4 -2.54,0; 5 0,0; 6 2.54,0; 7 5.08,0; 8 7.62,0; 9 10.16,0
1X06 = drill 1.016 long: 1 -6.35,0; 2 -3.81,0; 3 -1.27,0; 4 1.27,0; 5 3.81,0; 6 6.35,0
2X24 = drill 1.016 octagon: 1 -27.94,-1.27; 2 -27.94,1.27; 3 -25.4,-1.27; 4 -25.4,1.27; 5 -22.86,-1.27; 6 -22.86,1.27; 7 -20.32,-1.27; 8 -20.32,1.27; 9 -17.78,-1.27; 10 -17.78,1.27; 11 -15.24,-1.27; 12 -15.24,1.27; 13 -12.7,-1.27; 14 -12.7,1.27; 15 -10.16,-1.27; 16 -10.16,1.27; 17 -7.62,-1.27; 18 -7.62,1.27; 19 -5.08,-1.27; 20 -5.08,1.27; 21 -2.54,-1.27; 22 -2.54,1.27; 23 0,-1.27; 24 0,1.27; 25 2.54,-1.27; 26 2.54,1.27; 27 5.08,-1.27; 28 5.08,1.27; 29 7.62,-1.27; 30 7.62,1.27; 31 10.16,-1.27; 32 10.16,1.27; 33 12.7,-1.27; 34 12.7,1.27; 35 15.24,-1.27; 36 15.24,1.27; 37 17.78,-1.27; 38 17.78,1.27; 39 20.32,-1.27; 40 20.32,1.27; 41 22.86,-1.27; 42 22.86,1.27; 43 25.4,-1.27; 44 25.4,1.27; 45 27.94,-1.27; 46 27.94,1.27; 47 30.48,-1.27; 48 30.48,1.27
2X18 = drill 1.016 octagon: 1 -21.59,-1.27; 2 -21.59,1.27; 3 -19.05,-1.27; 4 -19.05,1.27; 5 -16.51,-1.27; 6 -16.51,1.27; 7 -13.97,-1.27; 8 -13.97,1.27; 9 -11.43,-1.27; 10 -11.43,1.27; 11 -8.89,-1.27; 12 -8.89,1.27; 13 -6.35,-1.27; 14 -6.35,1.27; 15 -3.81,-1.27; 16 -3.81,1.27; 17 -1.27,-1.27; 18 -1.27,1.27; 19 1.27,-1.27; 20 1.27,1.27; 21 3.81,-1.27; 22 3.81,1.27; 23 6.35,-1.27; 24 6.35,1.27; 25 8.89,-1.27; 26 8.89,1.27; 27 11.43,-1.27; 28 11.43,1.27; 29 13.97,-1.27; 30 13.97,1.27; 31 16.51,-1.27; 32 16.51,1.27; 33 19.05,-1.27; 34 19.05,1.27; 35 21.59,-1.27; 36 21.59,1.27
0204/7 = drill 0.813 octagon: 1 -3.81,0; 2 3.81,0
DIL32-6 = drill 0.813 long: 1 -17.78,-7.62; 2 -15.24,-7.62; 3 -12.7,-7.62; 4 -10.16,-7.62; 5 -7.62,-7.62; 6 -5.08,-7.62; 7 -2.54,-7.62; 8 0,-7.62; 9 2.54,-7.62; 10 5.08,-7.62; 11 7.62,-7.62; 12 10.16,-7.62; 13 12.7,-7.62; 14 15.24,-7.62; 15 17.78,-7.62; 16 20.32,-7.62; 17 20.32,7.62; 18 17.78,7.62; 19 15.24,7.62; 20 12.7,7.62; 21 10.16,7.62; 22 7.62,7.62; 23 5.08,7.62; 24 2.54,7.62; 25 0,7.62; 26 -2.54,7.62; 27 -5.08,7.62; 28 -7.62,7.62; 29 -10.16,7.62; 30 -12.7,7.62; 31 -15.24,7.62; 32 -17.78,7.62

### Placement (x,y rotation side)
C1  72.39,17.14 0 top
C2  46.35,14.61 0 top
C3  31.75,14.61 0 top
C4  17.14,14.61 0 top
C5  109.22,13.97 0 top
C6  128.27,15.24 0 top
C7  10.79,46.35 270 top
C8  31.75,95.25 180 top
C9  64.77,95.25 180 top
C10  97.79,95.25 180 top
C11  130.81,95.25 180 top
C12  148.91,8.26 0 top
GND1  141.92,93.34 0 top
GND2  10.16,6.99 0 top
IC1  77.47,34.29 90 top
IC2  47.62,26.67 90 top
IC3  33.02,26.67 90 top
IC4  18.41,26.67 90 top
IC5  110.49,26.67 90 top
IC6  129.54,26.67 90 top
IC8  21.59,45.09 0 top
JP2  141.92,24.77 270 top
JP3  6.03,75.56 270 top
JP4  6.03,24.77 270 top
JP7  153.35,49.85 270 top
JP8  13.02,78.11 90 top
JP9  48.26,6.99 180 top
JP10  105.41,6.99 180 top
R1  91.44,20.32 0 top
R2  91.44,22.86 0 top
R3  91.44,25.4 0 top
R4  91.44,27.94 0 top
R5  91.44,30.48 0 top
R6  91.44,33.02 0 top
R7  91.44,35.56 0 top
R8  91.44,38.1 0 top
R9  91.44,40.64 0 top
R10  91.44,43.18 0 top
R11  91.44,45.72 0 top
R12  63.5,48.26 180 top
R13  63.5,45.72 180 top
R14  63.5,43.18 180 top
R15  63.5,40.64 180 top
R16  63.5,38.1 180 top
UC1  26.67,74.3 270 top
UC2  59.69,74.3 270 top
UC3  92.71,74.3 270 top
UC4  125.73,74.3 270 top
VCC1  141.92,6.99 0 top
VCC2  10.16,93.34 0 top

### Tracks (layer width: path | path; a pad name or v marks a point on that pad's centre or on a via)
+5V
  Top 0.406: IC8.1 IC8.14 | UC3.31 UC3.32 | UC2.31 UC2.32 | UC1.31 UC1.32 | IC8.12 19.05,47.94 20.32,46.67 22.86,46.67 24.13,47.94 IC8.10
  Top 0.813: C12.+ VCC1.4 | VCC1.3 VCC1.4 | VCC1.4 VCC1.2 VCC1.1 | 106.68,10.79 121.28,10.79 C6.1 IC6.14 | 106.68,10.79 80.64,10.79 78.74,12.7 69.85,12.7 | 69.85,12.7 43.81,12.7 | 43.81,12.7 31.11,12.7 C3.1 26.99,14.61 25.4,16.19 18.41,16.19 16.83,14.61 C4.1 13.02,14.61 9.84,17.78 9.84,36.51 8.26,38.1 8.26,48.9 | 8.26,48.9 8.26,55.88 2.54,61.59 2.54,88.27 6.35,92.08 VCC2.1 VCC2.3 VCC2.4 | 34.29,97.79 18.41,97.79 15.24,94.61 VCC2.4 | 34.29,97.79 67.31,97.79 | 67.31,97.79 100.33,97.79 | 100.33,97.79 131.44,97.79 133.35,95.89 C11.1 UC4.32 | 106.68,10.79 C5.1 IC5.14 | C2.1 43.81,12.7 | C7.1 8.26,48.9 | VCC2.4 VCC2.2 | 34.29,97.79 C8.1 UC1.32 | 67.31,97.79 C9.1 UC2.32 | 100.33,97.79 C10.1 UC3.32 | C1.1 69.85,12.7
  Bottom 0.406: IC8.9 IC8.10 | IC8.12 IC8.13 IC8.14 | IC8.1 IC8.2 | UC4.31 UC4.32
  Bottom 0.813: C4.1 IC4.16 | C7.1 IC8.14 | C2.1 IC2.16 | C1.1 IC1.24 | VCC1.2 136.84,12.06 128.91,12.06 C6.1 | C3.1 IC3.16
/ALUCARRYIN
  Bottom 0.406: JP9.2 78.42,5.71 89.53,16.83 97.16,16.83 102.55,22.23 102.55,52.07 100.65,53.98 UC3.17
/ALUHI2MEM  (via drill 0.61 pad 1.27)
  Top 0.406: IC2.9 v43.81,55.24 | v112.39,44.45 101.6,55.24 v91.76,55.24 | v109.86,15.56 111.76,17.46 111.76,27.62 113.35,29.21 IC5.5
  Bottom 0.406: v109.86,15.56 103.5,15.56 99.06,11.11 97.47,11.11 96.52,10.16 JP10.25 | IC5.5 112.39,31.11 v112.39,44.45 | v43.81,55.24 v91.76,55.24
/ALULO2MEM  (via drill 0.61 pad 1.27)
  Top 0.406: IC2.10 45.72,34.92 v45.72,52.7 | v111.12,40.01 101.28,49.85 99.38,49.85 96.52,52.7 v92.71,52.7
  Bottom 0.406: v45.72,52.7 v92.71,52.7 | v111.12,40.01 111.12,29.84 IC5.4 116.2,24.77 116.2,18.41 115.57,17.78 103.19,17.78 98.42,13.02 97.16,13.02 96.2,13.02 92.39,13.02 91.44,12.06 JP10.29
/ALUSHR
  Bottom 0.406: JP9.1 78.42,8.26 88.9,18.73 96.52,18.73 100.65,22.86 100.65,49.53 93.66,56.52 UC3.15
/BUSIFCEN  (via drill 0.61 pad 1.27)
  Top 0.406: IC2.15 47.94,16.19 53.66,16.19 55.88,18.41 55.88,54.93 62.55,61.59 UC2.20 | v119.38,46.67 v103.19,62.87
  Bottom 0.406: IC8.4 21.59,43.81 22.86,45.09 22.86,58.1 25.08,60.33 42.23,60.33 44.77,57.78 61.59,57.78 65.41,61.59 UC2.20 75.25,61.59 76.52,62.87 v103.19,62.87 | JP10.5 121.92,13.02 120.02,14.92 120.02,46.04 v119.38,46.67
/CNT_SP
  Bottom 0.406: UC4.19 131.44,57.15 131.44,35.24 127.95,31.75 127.95,25.72 126.36,24.13 IC6.12
/CNTSP
  Top 0.406: JP10.3 128.59,12.38 128.59,23.81 IC6.11
/ENA
  Bottom 0.406: IC2.5 48.26,27.94 47.31,26.99 47.31,20.64 45.72,19.05 41.91,19.05 40.96,18.1 40.96,14.29 35.56,8.89 JP9.33
/ENABUS
  Bottom 0.406: JP10.22 98.11,2.22 28.89,2.22 26.67,4.45 26.67,9.53 31.11,13.97 31.11,26.99 34.61,30.48 IC3.6
/ENALU  (via drill 0.61 pad 1.27)
  Top 0.406: JP9.39 29.21,6.99 29.21,4.45 32.07,1.59 149.54,1.59 155.26,7.3 v155.26,22.23 | v151.76,22.23 138.11,22.23 136.21,24.13 IC6.3
  Bottom 0.406: v155.26,22.23 v151.76,22.23
/ENDP
  Bottom 0.406: JP9.44 20.64,3.49 16.51,3.49 13.97,6.03 13.97,9.21 10.79,12.38 10.79,30.48 12.06,31.75 20.64,31.75 21.91,30.48 IC4.6
/ENIPTR
  Bottom 0.406: JP9.38 31.75,6.99 31.75,8.89 36.51,13.65 36.51,15.56 34.61,17.46 34.61,25.72 35.56,26.67 38.1,26.67 38.73,27.3 38.73,32.38 38.1,33.02 IC3.7
/ENLMDR
  Bottom 0.406: JP9.34 36.83,6.99 36.83,8.89 41.27,13.34 45.09,13.34 48.26,16.51 48.26,24.45 49.21,25.4 IC2.4
/ENMAR
  Bottom 0.406: JP9.48 17.78,6.35 19.05,7.62 19.05,10.16 20.64,11.75 20.64,13.65 24.45,17.46 24.45,24.13 23.18,25.4 IC4.4
/ENMEM  (via drill 0.61 pad 1.27)
  Top 0.406: v132.72,10.16 v132.72,13.97
  Bottom 0.406: JP10.16 110.49,4.45 128.91,4.45 132.72,8.26 v132.72,10.16 | IC6.6 131.76,31.75 130.49,30.48 130.49,18.41 132.72,16.19 v132.72,13.97
/ENMSW  (via drill 0.61 pad 1.27)
  Top 0.406: v32.38,22.86 32.38,26.04 34.29,27.94 IC3.5
  Bottom 0.406: JP9.40 29.21,6.99 29.21,8.89 32.38,12.06 v32.38,22.86
/ENPC
  Bottom 0.406: JP9.42 22.23,2.54 16.19,2.54 13.02,5.71 13.02,8.89 9.84,12.06 9.84,32.7 11.43,34.29 20.64,34.29 21.91,33.02 IC4.7
/ENRMDR  (via drill 0.61 pad 1.27)
  Top 0.406: IC3.4 38.1,25.4 39.69,26.99 39.69,30.8 38.73,31.75 v32.7,31.75
  Bottom 0.406: JP9.41 25.4,14.29 27.3,16.19 27.3,31.11 27.94,31.75 v32.7,31.75
/ENSP
  Bottom 0.406: JP9.46 21.59,6.99 21.59,13.34 25.4,17.14 25.4,25.72 23.18,27.94 IC4.5
/ENX
  Bottom 0.406: JP9.36 34.29,6.99 34.29,8.89 40.01,14.61 40.01,18.41 41.59,20 41.59,20.95 42.23,21.59 45.72,21.59 46.35,22.23 46.35,28.89 47.94,30.48 IC2.6
/ENY
  Bottom 0.406: JP9.35 33.02,8.89 39.05,14.92 39.05,18.73 40.64,20.32 40.64,22.54 41.59,23.5 41.59,30.8 42.55,31.75 49.85,31.75 51.12,33.02 IC2.7
/FRET
  Top 0.406: UC1.19 32.38,59.05 20.95,70.48 15.56,70.48 14.29,71.75 JP8.1
/INC_MAR  (via drill 0.61 pad 1.27)
  Top 0.406: v149.22,3.81 147.96,2.54 41.27,2.54 JP9.32
  Bottom 0.406: UC4.20 137.79,57.15 137.79,43.18 149.22,31.75 v149.22,3.81
/INC_PC
  Bottom 0.406: UC4.21 131.76,64.14 130.49,62.87 130.49,35.88 126.36,31.75 IC6.9
/INCPC
  Bottom 0.406: JP10.1 127,12.06 122.87,16.19 122.87,32.07 125.09,34.29 IC6.8
/LATCH_I
  Bottom 0.406: JP9.47 12.7,13.34 12.7,26.67 13.97,27.94 IC4.12
/LATCH_NONE
  Bottom 0.406: IC8.5 24.13,39.37 22.54,37.78 16.51,37.78 14.61,35.88 IC4.9
/LATCH_S
  Bottom 0.406: JP9.45 20.32,7.62 19.05,6.35 19.05,5.08 18.41,4.45 17.14,4.45 14.92,6.67 14.92,9.53 11.75,12.7 11.75,29.21 13.02,30.48 IC4.11
/LATCHFLAGS  (via drill 0.61 pad 1.27)
  Top 0.406: JP10.12 113.03,6.99 103.5,6.99 102.87,6.35 102.87,4.76 101.92,3.81 45.4,3.81 44.45,4.76 44.45,9.53 42.55,11.43 v17.46,11.43
  Bottom 0.406: v17.46,11.43 17.46,17.46 IC4.15
/LDA
  Bottom 0.406: JP9.14 62.23,6.99 62.23,13.02 62.87,13.65 62.87,32.07 65.09,34.29 93.98,34.29 R6.2
/LDAHI
  Bottom 0.406: JP9.11 63.5,13.02 63.82,13.34 63.82,30.48 65.09,31.75 93.98,31.75 R5.2
/LDALO
  Bottom 0.406: JP9.12 64.77,6.99 64.77,27.94 66.04,29.21 93.98,29.21 R4.2
/LDDP
  Bottom 0.406: JP9.22 52.07,6.99 52.07,12.06 56.2,16.19 56.2,39.69 R14.2
/LDMAR
  Bottom 0.406: JP9.23 48.26,10.79 54.29,16.83 54.29,42.86 R12.2
/LDMARHI
  Bottom 0.406: JP9.17 55.88,12.06 59.05,15.24 59.05,34.61 61.91,37.47 61.91,45.4 63.5,46.99 93.98,46.99 R11.2
/LDMARLO
  Bottom 0.406: JP9.18 57.15,6.99 57.15,12.06 60.01,14.92 60.01,34.29 62.87,37.15 62.87,43.81 63.5,44.45 93.98,44.45 R10.2
/LDMDR
  Bottom 0.406: R3.2 93.98,26.67 66.99,26.67 65.72,25.4 65.72,8.57 JP9.9
/LDMDRHI
  Bottom 0.406: JP9.10 67.31,6.99 67.31,8.89 66.67,9.53 66.67,22.86 67.94,24.13 93.98,24.13 R2.2
/LDMDRLO
  Bottom 0.406: JP9.7 68.58,8.89 67.63,9.84 67.63,20.95 68.26,21.59 93.98,21.59 R1.2
/LDMEM  (via drill 0.61 pad 1.27)
  Top 0.406: R9.2 98.42,37.47 98.42,24.13 104.46,18.1 v104.46,14.29
  Bottom 0.406: JP10.15 109.22,9.53 v104.46,14.29
/LDMSW
  Bottom 0.406: JP9.20 54.61,6.99 54.61,12.06 58.1,15.56 58.1,36.51 R16.2
/LDPC
  Bottom 0.406: JP9.19 53.34,12.06 57.15,15.88 57.15,38.1 R15.2
/LDSP
  Bottom 0.406: JP9.21 50.8,12.06 55.24,16.51 55.24,41.27 R13.2
/LDX
  Bottom 0.406: JP9.13 60.96,13.34 61.91,14.29 61.91,32.38 66.36,36.83 93.98,36.83 R7.2
/LDY
  Bottom 0.406: JP9.16 59.69,6.99 59.69,13.34 60.96,14.61 60.96,32.7 64.77,36.51 64.77,38.1 66.04,39.37 93.98,39.37 R8.2
/LOAD_IR  (via drill 0.61 pad 1.27)
  Top 0.406: UC2.14 56.2,59.05 60.01,62.87 72.71,62.87 77.15,58.42 77.15,19.68 81.92,14.92 101.92,14.92 v104.46,12.38
  Bottom 0.406: JP10.26 97.79,6.99 99.69,6.99 100.33,7.62 100.33,8.89 100.97,9.53 101.6,9.53 v104.46,12.38
/MEM2ALUHI  (via drill 0.61 pad 1.27)
  Top 0.406: v47.31,51.44 47.31,33.97 IC2.11 | v109.86,38.1 96.52,51.44 v91.44,51.44 | IC5.2 116.2,19.68 116.2,17.14 v115.57,16.51
  Bottom 0.406: v47.31,51.44 v91.44,51.44 | IC5.2 109.86,26.04 v109.86,38.1 | JP10.27 93.98,11.11 94.93,12.06 98.74,12.06 103.5,16.83 115.25,16.83 v115.57,16.51
/MEM2ALULO  (via drill 0.61 pad 1.27)
  Top 0.406: IC2.12 42.86,27.94 41.59,29.21 v41.59,50.16 | v108.58,36.2 94.61,50.16 v90.17,50.16
  Bottom 0.406: v41.59,50.16 v90.17,50.16 | 113.67,19.05 111.12,19.05 109.86,20.32 104.46,20.32 98.11,13.97 90.49,13.97 88.9,12.38 JP10.31 | v108.58,36.2 108.58,25.4 108.58,25.08 108.58,24.13 113.67,19.05 | IC5.1 113.67,19.05
/MEMOP  (via drill 0.61 pad 1.27)
  Top 0.406: v112.71,59.05 UC4.14
  Bottom 0.406: JP10.11 114.3,9.21 117.16,12.06 117.16,42.86 112.71,47.31 v112.71,59.05
ADDRBUS0
  Top 0.406: IC4.2 21.27,20.32 17.78,23.81 17.78,46.99 17.78,48.58 17.78,50.8 16.51,52.07 16.51,56.83 18.73,59.05 UC1.14
ADDRBUS1
  Top 0.406: IC4.3 21.27,22.86 20.32,23.81 20.32,43.81 21.91,45.4 24.13,45.4 25.4,46.67 25.4,54.61 23.5,56.52 UC1.15
ALUMODE
  Bottom 0.406: JP9.3 74.93,6.99 78.42,6.99 89.22,17.78 96.84,17.78 101.6,22.54 101.6,49.85 98.42,53.02 98.42,55.56 99.38,56.52 UC3.18
ALUOP0
  Bottom 0.406: JP9.4 74.93,4.45 84.45,4.45 85.09,5.08 85.09,11.11 89.85,15.88 97.47,15.88 103.5,21.91 103.5,56.52 100.97,59.05 UC3.19
ALUOP1
  Bottom 0.406: JP9.6 73.34,3.49 86.68,3.49 87.63,4.45 87.63,12.38 90.17,14.92 97.79,14.92 104.46,21.59 104.46,58.74 101.6,61.59 UC3.20
ALUOP2  (via drill 0.61 pad 1.27)
  Top 0.406: UC3.21 99.06,62.87 82.87,62.87 80.01,60.01 v80.01,19.68
  Bottom 0.406: v80.01,19.68 80.01,17.14 JP9.5
ALUOP3  (via drill 0.61 pad 1.27)
  Top 0.406: v78.42,20.32 78.42,58.74 71.75,65.41 59.69,65.41 55.88,61.59 UC2.13
  Bottom 0.406: JP9.8 69.85,6.99 69.85,9.21 78.42,17.78 v78.42,20.32
BUSCLKA  (via drill 0.61 pad 1.27)
  Top 0.406: IC1.18 71.12,35.56 75.56,31.11 75.56,20 81.92,13.65 100.97,13.65 v102.23,12.38
  Bottom 0.406: v102.23,12.38 99.06,9.21 JP10.23
BUSIFCMODE0  (via drill 0.61 pad 1.27)
  Top 0.406: IC4.14 12.38,25.08 12.38,51.44 14.29,53.34 14.29,59.69 17.46,62.87 v24.45,62.87 | IC2.14 46.04,22.86 49.85,19.05 53.98,19.05 54.93,20 54.93,56.52 53.66,57.78 49.85,57.78 v44.77,62.87
  Bottom 0.406: UC2.21 66.04,62.87 v44.77,62.87 v24.45,62.87
BUSIFCMODE1
  Top 0.406: IC4.13 15.56,25.4 16.83,26.67 16.83,36.83 15.24,38.42 15.24,46.99 15.24,47.62 15.24,58.42 18.41,61.59 UC1.13 22.54,61.59 40.64,43.5 40.64,27.3 42.55,25.4 IC2.13
CLBUS0
  Top 0.406: IC2.2 50.8,20.32 48.58,22.54 48.58,52.39 39.37,61.59 UC1.20
CLBUS1
  Top 0.406: IC2.3 50.8,22.86 49.53,24.13 49.53,52.7 38.1,64.14 UC1.21
CLK0D  (via drill 0.61 pad 1.27)
  Top 0.406: v134.94,7.62 136.84,9.53 136.84,18.41 133.67,21.59 IC6.2
  Bottom 0.406: IC6.2 132.72,21.59 131.44,22.86 131.44,27.94 132.72,29.21 IC6.5 | JP10.17 107.95,6.99 107.95,4.45 108.9,3.49 130.81,3.49 v134.94,7.62
CNT0
  Bottom 0.406: UC4.8 109.22,74.3 107.95,75.56 92.71,75.56 91.44,74.3 UC3.8 76.52,74.3 75.25,75.56 60.96,75.56 59.69,74.3 UC2.8 43.81,74.3 42.55,75.56 27.94,75.56 26.67,74.3 UC1.8 JP8.2
CNT1
  Bottom 0.406: UC4.7 109.22,76.83 107.95,78.11 92.71,78.11 91.44,76.83 UC3.7 76.52,76.83 75.25,78.11 60.96,78.11 59.69,76.83 UC2.7 43.81,76.83 42.55,78.11 27.94,78.11 26.67,76.83 UC1.7 JP8.3
CNT2
  Bottom 0.406: UC4.6 109.22,79.38 107.95,80.64 92.71,80.64 91.44,79.38 UC3.6 76.52,79.38 75.25,80.64 60.96,80.64 59.69,79.38 UC2.6 43.81,79.38 42.55,80.64 27.94,80.64 26.67,79.38 UC1.6 JP8.4
CNT3
  Bottom 0.406: UC4.5 109.22,81.92 107.95,83.19 92.71,83.19 91.44,81.92 UC3.5 76.52,81.92 75.25,83.19 60.96,83.19 59.69,81.92 UC2.5 43.81,81.92 42.55,83.19 27.94,83.19 26.67,81.92 UC1.5 JP8.5
CNT4
  Top 0.406: UC1.27 30.48,83.19 14.29,83.19 JP8.6
  Bottom 0.406: UC4.27 125.73,79.38 124.46,78.11 109.22,78.11 107.95,79.38 UC3.27 92.71,79.38 91.44,78.11 76.52,78.11 75.25,79.38 UC2.27 60.96,79.38 59.69,78.11 43.81,78.11 42.55,79.38 UC1.27
CRBUS0
  Bottom 0.406: UC1.17 33.97,53.98 32.7,52.7 32.7,45.4 40.64,37.47 40.64,24.13 39.69,23.18 39.69,21.91 38.1,20.32 IC3.2
CRBUS1
  Bottom 0.406: UC1.18 31.75,53.98 31.75,45.09 39.69,37.15 39.69,24.45 38.1,22.86 IC3.3
FAULT  (via drill 0.61 pad 1.27)
  Top 0.406: v73.98,41.91 66.36,41.91 65.41,40.96 65.41,37.47 IC1.19 | IC6.10 120.65,29.21 119.38,30.48 103.82,30.48 99.38,34.92 99.38,40.64 v98.11,41.91 | JP10.28 95.25,6.99 99.69,6.99 100.33,7.62 100.33,8.89 100.97,9.53 123.83,9.53 127.64,13.34 127.64,19.68 IC6.13
  Bottom 0.406: IC6.13 123.83,23.5 123.83,27.3 IC6.10 | v98.11,41.91 v73.98,41.91
FC
  Bottom 0.406: UC1.9 26.67,71.75 27.94,73.03 42.55,73.03 43.81,71.75 UC2.9 59.69,71.75 60.96,73.03 75.25,73.03 76.52,71.75 UC3.9 91.44,71.75 92.71,73.03 107.95,73.03 109.22,71.75 UC4.9 119.06,71.75 121.92,68.9 121.92,15.88 125.73,12.06 125.73,6.99 JP10.2
FN
  Bottom 0.406: UC1.11 26.67,66.67 27.94,67.94 42.55,67.94 43.81,66.67 UC2.11 59.69,66.67 60.96,67.94 75.25,67.94 76.52,66.67 UC3.11 91.44,66.67 92.71,67.94 107.95,67.94 109.22,66.67 UC4.11 118.75,66.67 120.02,65.41 120.02,53.02 116.52,49.53 116.52,46.04 119.06,43.5 119.06,14.29 120.65,12.7 120.65,6.99 JP10.6
FV
  Bottom 0.406: UC1.12 26.67,64.14 27.94,65.41 42.55,65.41 43.81,64.14 UC2.12 59.69,64.14 60.96,65.41 75.25,65.41 76.52,64.14 UC3.12 91.44,64.14 92.71,65.41 107.95,65.41 109.22,64.14 UC4.12 117.16,64.14 114.62,61.59 114.62,46.67 118.11,43.18 118.11,6.99 JP10.8
FZ
  Bottom 0.406: UC1.10 26.67,69.22 27.94,70.48 42.55,70.48 43.81,69.22 UC2.10 59.69,69.22 60.96,70.48 75.25,70.48 76.52,69.22 UC3.10 91.44,69.22 92.71,70.48 107.95,70.48 109.22,69.22 UC4.10 119.06,69.22 120.97,67.31 120.97,15.56 123.19,13.34 123.19,6.99 JP10.4
GND
  Bottom 0.406: IC3.15 IC3.14 IC3.13
  pour Top (isolate 0.61): 0,100.01 160.02,100.01 160.02,0 0,0
  pour Bottom (isolate 0.61): 0,100.01 160.02,100.01 160.02,0 0,0
LOAD0  (via drill 0.61 pad 1.27)
  Top 0.406: IC1.23 60.96,31.75 v60.96,56.52
  Bottom 0.406: v60.96,56.52 UC2.15
LOAD1
  Top 0.406: IC1.22 61.91,33.34 61.91,50.48 65.41,53.98 UC2.17
LOAD2
  Top 0.406: IC1.21 63.5,34.29 63.5,49.53 65.09,51.12 67.63,51.12 69.22,52.7 69.22,55.24 67.94,56.52 UC2.18
LOAD3
  Top 0.406: UC2.19 70.17,56.2 70.17,52.39 67.94,50.16 65.41,50.16 64.45,49.21 64.45,35.88 IC1.20
LOAD_FLAGS0  (via drill 0.61 pad 1.27)
  Top 0.406: UC3.13 81.6,58.1 v81.6,19.05 | v75.56,10.16 50.48,10.16 49.53,9.21 49.53,6.99 JP9.24
  Bottom 0.406: v81.6,19.05 81.6,16.19 v75.56,10.16
LOAD_FLAGS1  (via drill 0.61 pad 1.27)
  Top 0.406: UC3.14 83.19,57.15 v83.19,18.41 | v78.42,10.48 77.47,11.43 48.9,11.43 46.99,9.53 46.99,6.99 JP9.26
  Bottom 0.406: v83.19,18.41 83.19,15.24 v78.42,10.48
MDRLDINHBT
  Bottom 0.406: JP9.43 22.86,13.02 26.35,16.51 26.35,40.96 IC8.6
MEMSEG
  Top 0.406: JP10.14 113.03,4.45 146.05,4.45 147.96,6.35 151.76,6.35 153.03,7.62 153.03,34.29 UC4.17
N$1
  Bottom 0.406: IC1.16 R15.1
N$8
  Top 0.406: IC6.1 129.54,22.86 129.54,26.35 127.95,27.94 118.11,27.94 IC5.3
N$15
  Top 0.406: IC6.4 129.54,30.48 120.97,30.48 119.7,31.75 IC5.6
N$31
  Bottom 0.406: R1.1 IC1.1
N$33
  Bottom 0.406: R2.1 IC1.2
N$34
  Bottom 0.406: R3.1 IC1.3
N$35
  Bottom 0.406: R4.1 IC1.4
N$36
  Bottom 0.406: R5.1 IC1.5
N$37
  Bottom 0.406: R6.1 IC1.6
N$38
  Bottom 0.406: R7.1 IC1.7
N$39
  Bottom 0.406: IC1.8 R8.1
N$40
  Bottom 0.406: R9.1 IC1.9
N$41
  Bottom 0.406: R10.1 IC1.10
N$42
  Bottom 0.406: IC1.11 R11.1
N$43
  Bottom 0.406: IC1.13 R12.1
N$44
  Bottom 0.406: IC1.14 R13.1
N$45
  Bottom 0.406: IC1.15 R14.1
N$56
  Bottom 0.406: IC1.17 R16.1
OP0
  Bottom 0.406: UC1.26 42.55,76.83 43.81,75.56 59.69,75.56 60.96,76.83 UC2.26 75.25,76.83 76.52,75.56 91.44,75.56 92.71,76.83 UC3.26 107.95,76.83 109.22,75.56 124.46,75.56 125.73,76.83 UC4.26 140.97,76.83 143.51,74.3 143.51,48.9 152.72,39.69 JP7.9
OP1
  Top 0.406: UC3.23 101.6,70.48 132.08,70.48 UC4.23 139.7,69.22 144.78,64.14 144.78,50.16 152.72,42.23 JP7.8
  Bottom 0.406: UC1.23 42.55,69.22 43.81,67.94 59.69,67.94 60.96,69.22 UC2.23 75.25,69.22 76.52,67.94 91.44,67.94 92.71,69.22 UC3.23
OP2
  Top 0.406: UC4.25 142.24,74.3 146.05,70.48 146.05,51.44 152.72,44.77 JP7.7
  Bottom 0.406: UC4.25 125.73,74.3 124.46,73.03 109.22,73.03 107.95,74.3 UC3.25 92.71,74.3 91.44,73.03 76.52,73.03 75.25,74.3 UC2.25 60.96,74.3 59.69,73.03 43.81,73.03 42.55,74.3 UC1.25
OP3
  Top 0.406: UC4.4 124.46,84.45 125.73,83.19 140.97,83.19 147.32,76.83 147.32,52.7 152.72,47.31 JP7.6
  Bottom 0.406: UC4.4 109.22,84.45 107.95,85.72 92.71,85.72 91.44,84.45 UC3.4 76.52,84.45 75.25,85.72 60.96,85.72 59.69,84.45 UC2.4 43.81,84.45 42.55,85.72 27.94,85.72 26.67,84.45 UC1.4
OP4
  Bottom 0.406: UC1.28 42.55,81.92 43.81,80.64 59.69,80.64 60.96,81.92 UC2.28 75.25,81.92 76.52,80.64 91.44,80.64 92.71,81.92 UC3.28 107.95,81.92 109.22,80.64 124.46,80.64 125.73,81.92 UC4.28 143.83,81.92 148.59,77.15 148.59,53.98 152.72,49.85 JP7.5
OP5
  Bottom 0.406: UC1.29 42.55,84.45 43.81,83.19 59.69,83.19 60.96,84.45 UC2.29 75.25,84.45 76.52,83.19 91.44,83.19 92.71,84.45 UC3.29 107.95,84.45 109.22,83.19 124.46,83.19 125.73,84.45 UC4.29 142.88,84.45 149.86,77.47 149.86,55.24 152.72,52.39 JP7.4
OP6
  Top 0.406: JP7.3 152.72,54.93 151.13,56.52 151.13,77.79 143.19,85.72 125.73,85.72 124.46,87 UC4.3
  Bottom 0.406: UC4.3 109.22,87 107.95,88.27 92.71,88.27 91.44,87 UC3.3 76.52,87 75.25,88.27 60.96,88.27 59.69,87 UC2.3 43.81,87 42.55,88.27 27.94,88.27 26.67,87 UC1.3
OP7
  Bottom 0.406: UC1.2 26.67,89.53 27.94,90.81 42.55,90.81 43.81,89.53 UC2.2 59.69,89.53 60.96,90.81 75.25,90.81 76.52,89.53 UC3.2 91.44,89.53 92.71,90.81 107.95,90.81 109.22,89.53 UC4.2 124.46,89.53 125.73,88.27 143.83,88.27 155.57,76.52 155.57,58.74 154.31,57.47 JP7.2
OP8
  Bottom 0.406: UC1.30 42.55,87 43.81,85.72 59.69,85.72 60.96,87 UC2.30 75.25,87 76.52,85.72 91.44,85.72 92.71,87 UC3.30 107.95,87 109.22,85.72 124.46,85.72 125.73,87 UC4.30 143.51,87 153.35,77.15 JP7.1
PROT  (via drill 0.61 pad 1.27)
  Top 0.406: v141.29,38.1 122.87,56.52 UC4.15
  Bottom 0.406: JP10.21 102.87,6.99 102.87,3.81 104.14,2.54 144.15,2.54 148.27,6.67 148.27,31.11 v141.29,38.1
SP_DIR
  Top 0.406: JP10.20 106.36,3.49 146.69,3.49 148.59,5.4 152.08,5.4 153.99,7.3 153.99,34.92 135.89,53.02 135.89,54.93 134.3,56.52 UC4.18

### Text on the board
Top: #3
_tsilk: VCC2 | GND1 | UC1 | UC2 | UC3 | UC4 | AM29F020P | AM29F020P | AM29F020P | AM29F020P | JP3 | JP8 | JP7 | 74LS08N | IC8 | JP4 | JP2 | 74LS154N | 70 | 74LS00N | 74LS32N | 74LS139N | 74LS139N | 74LS139N | IC1 | IC5 | IC6 | IC4 | IC3 | IC2 | GND2 | VCC1 | 10u | JP9 | JP10